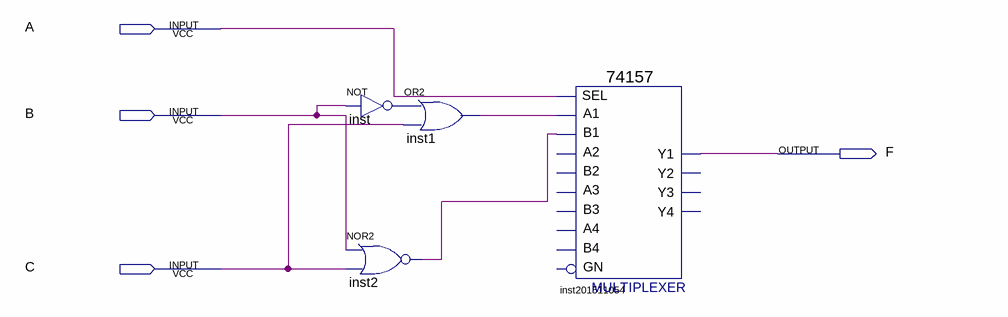
[diagram p0: schematic sheet]
// Quartus schematic lab04_2_3.bdf as structural Verilog: 4 symbols, 4 pins
module lab04_2_3 (
  input  A,
  input  B,
  input  C,
  output F
);

  wire inst1_out, inst2_out, inst_out;

  not inst (inst_out, B);
  nor inst2 (inst2_out, B, C);
  or inst1 (inst1_out, inst_out, C);
  \74157  inst201511054 (
    .A1(inst1_out), .B1(inst2_out), .SEL(A), .Y1(F));  // open: B2, A3, B3, A2, B4, GN, A4, Y2, Y4, Y3
endmodule
